# Altium schematic sheet cardio.SchDoc
size A4
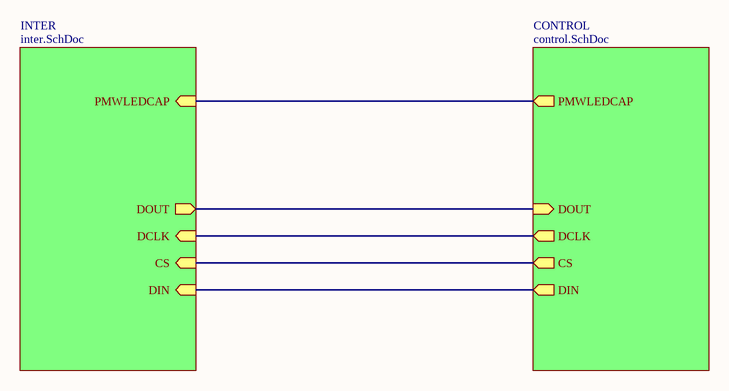
[diagram p0: cardio.SchDoc]

## Sub-sheets
CONTROL = control.SchDoc: PMWLEDCAP (out), DOUT (in), DCLK (out), CS (out), DIN (out)
INTER = inter.SchDoc: PMWLEDCAP (in), DOUT (out), DCLK (in), CS (in), DIN (in)

## Nets
(unnamed): sheet INTER/PMWLEDCAP, sheet CONTROL/PMWLEDCAP
(unnamed): sheet INTER/DOUT, sheet CONTROL/DOUT
(unnamed): sheet INTER/DCLK, sheet CONTROL/DCLK
(unnamed): sheet INTER/CS, sheet CONTROL/CS
(unnamed): sheet INTER/DIN, sheet CONTROL/DIN